# Altium project Bidirectional Charger P1.PrjPcb
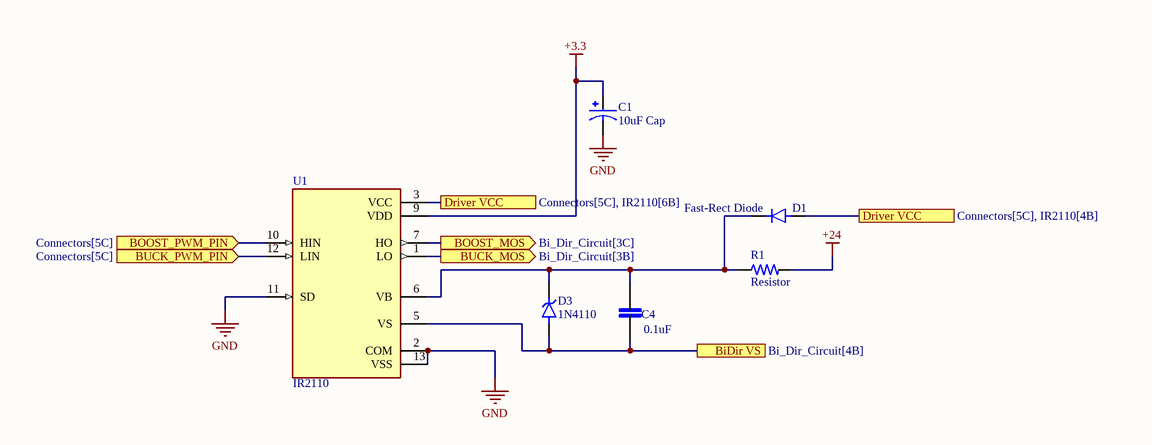
[diagram p0: IR2110.SchDoc]
3 sheets, 55 parts. Net scope: flat (ports and power ports of the same name join across sheets).
Board file: DC DC Board.PcbDoc
Sheets:
  IR2110.SchDoc
  Bi_Dir_Circuit.SchDoc
  Connectors.SchDoc

## Sheet IR2110.SchDoc
size A3; SheetNumber: 1; SheetTotal: 3

### Parts
C1  10uF Cap  [CAP_10uF]
C4  0.1uF  [Ceramic Capacitor]
D1  Fast-Rect Diode  [Common Trhough Hole]
D3  1N4110  [Common Trhough Hole]
R1  Resistor  [Resistor_Through Hole]
U1  IR2110  [IR2110]

### Ports
BiDir VS (see Bi_Dir_Circuit[4B]), BOOST_MOS (out, see Bi_Dir_Circuit[3C]), BOOST_PWM_PIN (in, see Connectors[5C]), BUCK_MOS (out, see Bi_Dir_Circuit[3B]), BUCK_PWM_PIN (in, see Connectors[5C]), Driver VCC (see Connectors[5C], IR2110[4B]), Driver VCC (see Connectors[5C], IR2110[6B])

### Nets
+3.3: C1.P U1.9(VDD)
+24: R1.2
GND: C1.N U1.2(COM) U1.11(SD) U1.13(VSS)
NetC4_1: C4.1 D3.2(A) U1.5(VS) ; port BiDir VS
NetC4_2: C4.2 D1.1(K) D3.1(K) R1.1 U1.6(VB)
NetD1_2: D1.2(A) U1.3(VCC) ; port Driver VCC
NetD7_C: U1.1(LO) ; port BUCK_MOS
NetD8_C: U1.7(HO) ; port BOOST_MOS
NetJ5_1: U1.10(HIN) ; port BOOST_PWM_PIN
NetJ5_3: U1.12(LIN) ; port BUCK_PWM_PIN

### Library data of the parts
C1 = 10uF Cap: CAP ALUM 10UF 20% 50V RADIAL; MP: ECE-A1HN100UI; MF: Panasonic; SnapEDA_Link: https://www.snapeda.com/parts/ECE-A1HN100UI/Panasonic/view-part/2321690/?ref=snap; Price: None; Check_prices: https://www.snapeda.com/parts/ECE-A1HN100UI/Panasonic/view-part/2321690/?ref=eda; Value: *; Availability: In Stock; Package: RADIAL-2 Panasonic
C4 = Ceramic Capacitor: MP: LD051A121KAB2A; MF: AVX; SnapEDA_Link: https://www.snapeda.com/parts/LD051A121KAB2A/AVX/view-part/?ref=snap; Package: 0805 AVX; Check_prices: https://www.snapeda.com/parts/LD051A121KAB2A/AVX/view-part/?ref=eda; Purchase-URL: https://pricing.snapeda.com/search/part/LD051A121KAB2A/?ref=eda; Price: None; Value: *; Availability: In Stock
D1 = Normal Diode: MF: NTE Electronics, Inc.; MP: 1N4007; Package: DO-41 NTE Electronics; Check_prices: https://www.snapeda.com/parts/1N4007/NTE+Electronics/view-part/?ref=eda; Value: *; Purchase-URL: https://pricing.snapeda.com/search/part/1N4007/?ref=eda; Availability: In Stock; SnapEDA_Link: https://www.snapeda.com/parts/1N4007/NTE+Electronics/view-part/?ref=snap; Price: None
D3 = Zener Diode: MP: 1SMA5926; MF: Taiwan Semiconductor; Package: SMA-2 Taiwan Semiconductor; Availability: In Stock; Purchase-URL: https://pricing.snapeda.com/search/part/1SMA5926/?ref=eda; SnapEDA_Link: https://www.snapeda.com/parts/1SMA5926/Taiwan+Semiconductor/view-part/?ref=snap; Price: None; Check_prices: https://www.snapeda.com/parts/1SMA5926/Taiwan+Semiconductor/view-part/?ref=eda; Value: *
R1 = Resistor: Power_Rating: .25 W; MP: 2-2176053-0; Tolerance: 1%; Resistance: .33; MF: TE Connectivity; Price: None; Availability: In Stock; EU_RoHS_Compliance: Compliant with Exemptions; Package: 0805; Value: *; SnapEDA_Link: https://www.snapeda.com/parts/2-2176053-0/TE+Connectivity/view-part/?ref=snap; Check_prices: https://www.snapeda.com/parts/2-2176053-0/TE+Connectivity/view-part/?ref=eda
U1 = IR2110: Half-Bridge Gate Driver IC Non-Inverting 16-SOIC; MF: Infineon; Package: SOIC-16 International Rectifier; Purchase-URL: https://pricing.snapeda.com/search/part/IR2110/?ref=eda; Value: *; SnapEDA_Link: https://www.snapeda.com/parts/IR2110/Infineon+Technologies/view-part/?ref=snap; Price: None; MP: IR2110; Check_prices: https://www.snapeda.com/parts/IR2110/Infineon+Technologies/view-part/?ref=eda; Availability: In Stock

## Sheet Bi_Dir_Circuit.SchDoc
size A2; SheetNumber: 2; SheetTotal: 3
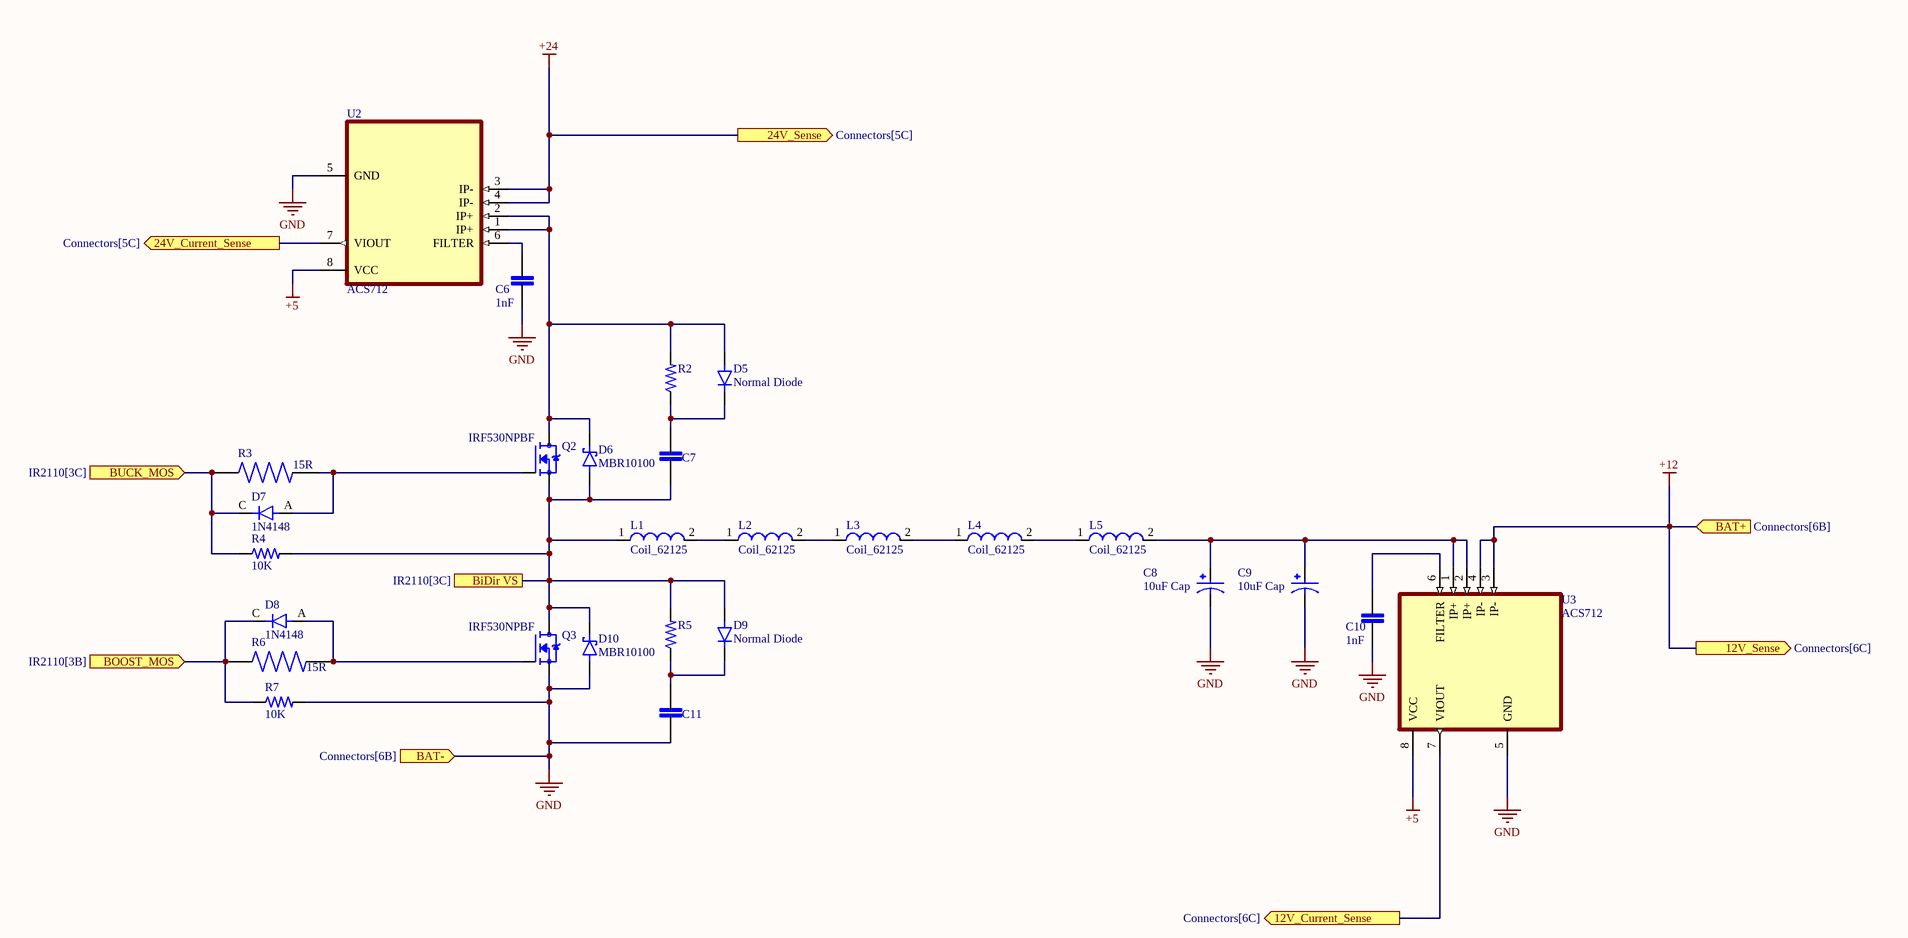
[diagram p1: Bi_Dir_Circuit.SchDoc]

### Parts
C6  1nF  [Ceramic Capacitor]
C7  Ceramic Capacitor  [Ceramic Capacitor]  (value not drawn)
C8  10uF Cap  [2200uF_Cap]
C9  10uF Cap  [2200uF_Cap]
C10  1nF  [Ceramic Capacitor]
C11  Ceramic Capacitor  [Ceramic Capacitor]  (value not drawn)
D5  Normal Diode  [Common Trhough Hole]
D6  MBR10100  [MBR10100]
D7  1N4148  [1N4007 DIODE]
D8  1N4148  [1N4007 DIODE]
D9  Normal Diode  [Common Trhough Hole]
D10  MBR10100  [MBR10100]
L1  Coil_62125  [Coil 65125]
L2  Coil_62125  [Coil 65125]
L3  Coil_62125  [Coil 65125]
L4  Coil_62125  [Coil 65125]
L5  Coil_62125  [Coil 65125]
Q2  IRF530NPBF  [IRF530N]
Q3  IRF530NPBF  [IRF530N]
R2  Resistor  [Resistor_Through Hole]  (value not drawn)
R3  15R  [Resistor_Through Hole]
R4  10K  [Resistor_Through Hole]
R5  Resistor  [Resistor_Through Hole]  (value not drawn)
R6  15R  [Resistor_Through Hole]
R7  10K  [Resistor_Through Hole]
U2  ACS712  [ACS712]
U3  ACS712  [ACS712]

### Ports
12V_Current_Sense (out, see Connectors[6C]), 12V_Sense (out, see Connectors[6C]), 24V_Current_Sense (out, see Connectors[5C]), 24V_Sense (out, see Connectors[5C]), BAT+ (in, see Connectors[6B]), BAT- (in, see Connectors[6B]), BiDir VS (see IR2110[3C]), BOOST_MOS (in, see IR2110[3B]), BUCK_MOS (in, see IR2110[3C])

### Nets
+5: U2.8(VCC) U3.8(VCC)
+12: U3.3(IP-) U3.4(IP-) ; port 12V_Sense, port BAT+
+24: U2.3(IP-) U2.4(IP-) ; port 24V_Sense
GND: C6.1 C8.N C9.N C10.1 C11.1 D10.3(A) Q3.3(S) R7.2 U2.5(GND) U3.5(GND) ; port BAT-
NetC4_1: C7.1 D6.3(A) D9.2(A) D10.1(K) L1.1 Q2.3(S) Q3.2(D) R4.2 R5.2 ; port BiDir VS
NetC6_2: C6.2 U2.6(FILTER)
NetC7_2: C7.2 D5.1(K) R2.1
NetC8_P: C8.P C9.P L5.2 U3.1(IP+) U3.2(IP+)
NetC10_2: C10.2 U3.6(FILTER)
NetC11_2: C11.2 D9.1(K) R5.1
NetD5_2: D5.2(A) D6.1(K) Q2.2(D) R2.2 U2.1(IP+) U2.2(IP+)
NetD7_A: D7.A Q2.1(G) R3.2
NetD7_C: D7.C R3.1 R4.1 ; port BUCK_MOS
NetD8_A: D8.A Q3.1(G) R6.2
NetD8_C: D8.C R6.1 R7.1 ; port BOOST_MOS
NetJ4_2: U3.7(VIOUT) ; port 12V_Current_Sense
NetJ4_3: U2.7(VIOUT) ; port 24V_Current_Sense
NetL1_2: L1.2 L2.1
NetL2_2: L2.2 L3.1
NetL3_2: L3.2 L4.1
NetL4_2: L4.2 L5.1

### Library data of the parts
C6 C7 C10 C11 = Ceramic Capacitor: MP: LD051A121KAB2A; MF: AVX; SnapEDA_Link: https://www.snapeda.com/parts/LD051A121KAB2A/AVX/view-part/?ref=snap; Package: 0805 AVX; Check_prices: https://www.snapeda.com/parts/LD051A121KAB2A/AVX/view-part/?ref=eda; Purchase-URL: https://pricing.snapeda.com/search/part/LD051A121KAB2A/?ref=eda; Price: None; Value: *; Availability: In Stock
C8 C9 = 10uF Cap: as C1 on sheet IR2110; SnapEDA_Link: https://www.snapeda.com/parts/ECE-A1HN100UI/Panasonic/view-part/2321690/?ref=snap; Price: None; Check_prices: https://www.snapeda.com/parts/ECE-A1HN100UI/Panasonic/view-part/2321690/?ref=eda; Value: *; Availability: In Stock; Package: RADIAL-2 Panasonic
D5 D9 = Normal Diode: MF: NTE Electronics, Inc.; MP: 1N4007; Package: DO-41 NTE Electronics; Check_prices: https://www.snapeda.com/parts/1N4007/NTE+Electronics/view-part/?ref=eda; Value: *; Purchase-URL: https://pricing.snapeda.com/search/part/1N4007/?ref=eda; Availability: In Stock; SnapEDA_Link: https://www.snapeda.com/parts/1N4007/NTE+Electronics/view-part/?ref=snap; Price: None
D6 D10 = MBR10100: MF: Diodes Inc.; MP: 1N5817-T; Package: DO-41 Diodes Inc.; Price: None; Check_prices: https://www.snapeda.com/parts/1N5817-T/Diodes+Inc./view-part/?ref=eda; Value: *; SnapEDA_Link: https://www.snapeda.com/parts/1N5817-T/Diodes+Inc./view-part/?ref=snap; Availability: In Stock; Purchase-URL: https://pricing.snapeda.com/search/part/1N5817-T/?ref=eda
D7 D8 = 1N4007: Diode Standard 1000 V 1A Through Hole DO-41; MF: NTE Electronics, Inc.; Package: DO-41 NTE Electronics; Check_prices: https://www.snapeda.com/parts/1N4007/NTE+Electronics/view-part/?ref=eda; Value: *; Purchase-URL: https://pricing.snapeda.com/search/part/1N4007/?ref=eda; Availability: In Stock; SnapEDA_Link: https://www.snapeda.com/parts/1N4007/NTE+Electronics/view-part/?ref=snap; MP: 1N4007; Price: None
L1-L5 = Coil_62125: Inductor Power Wirewound 470uH 10% 1KHz 25Q-Factor Ferrite 210mA 3.3Ohm DCR T/R; MF: Bourns; MP: SDR0604-471KL; Digi-Key_Part_Number: SDR0604-471KLCT-ND; Package: Nonstandard Bourns; Value: *; SnapEDA_Link: https://www.snapeda.com/parts/SDR0604-471KL/Bourns/view-part/567387/?ref=snap; Digi-Key_Purchase_URL: https://www.digikey.com/product-detail/en/bourns-inc/SDR0604-471KL/SDR0604-471KLCT-ND/2352941?utm_source=snapeda&utm_medium=aggregator&utm_campaign=symbol
Q2 Q3 = IRF530NPBF: RoHS Compliant | Low RDS(on) | Industry-leading quality | Dynamic dv/dt Rating | Fast Switching | Fully Avalanche Rated | 175C Operating Temperature; MF: Infineon Technologies; Purchase-URL: https://pricing.snapeda.com/search/part/IRF530NPBF/?ref=eda; Check_prices: https://www.snapeda.com/parts/IRF530NPBF/Infineon+Technologies/view-part/?ref=eda; SnapEDA_Link: https://www.snapeda.com/parts/IRF530NPBF/Infineon+Technologies/view-part/?ref=snap; Price: None; Availability: In Stock; Package: TO-220 Infineon; MP: IRF530NPBF; Value: *
R2 R4 R5 R7 = Resistor: as R1 on sheet IR2110; Price: None; Availability: In Stock; EU_RoHS_Compliance: Compliant with Exemptions; Package: 0805; Value: *; SnapEDA_Link: https://www.snapeda.com/parts/2-2176053-0/TE+Connectivity/view-part/?ref=snap; Check_prices: https://www.snapeda.com/parts/2-2176053-0/TE+Connectivity/view-part/?ref=eda
R3 R6 = Resistor_Through Hole: 1.02 Ohms Â±1% 0.25W, 1/4W Through Hole Resistor Axial Metal Film; MP: MFR-25FTE52-1R; MF: Yageo; Availability: Warning; Value: *; Check_prices: https://www.snapeda.com/parts/MFR-25FTE52-1R/Yageo/view-part/4629919/?ref=eda; Package: Axial Yageo; Price: None; SnapEDA_Link: https://www.snapeda.com/parts/MFR-25FTE52-1R/Yageo/view-part/4629919/?ref=snap; Purchase-URL: https://pricing.snapeda.com/search/part/MFR-25FTE52-1R/?ref=eda
U2 U3 = ACS712: Current Sensor 5A 1 Channel Hall Effect, Open Loop Bidirectional 8-SOIC (0.154, 3.90mm Width); MP: ACS712ELCTR-05B-T; MF: Allegro MicroSystems LLC; SnapEDA_Link: https://www.snapeda.com/parts/ACS712ELCTR-05B-T/Allegro+MicroSystems+LLC/view-part/?ref=snap; Package: SOIC-8 Allegro MicroSystems LLC; Check_prices: https://www.snapeda.com/parts/ACS712ELCTR-05B-T/Allegro+MicroSystems+LLC/view-part/?ref=eda; Purchase-URL: https://pricing.snapeda.com/search/part/ACS712ELCTR-05B-T/?ref=eda; Price: None; Value: *; Availability: In Stock

## Sheet Connectors.SchDoc
size A3; SheetNumber: 3; SheetTotal: 3
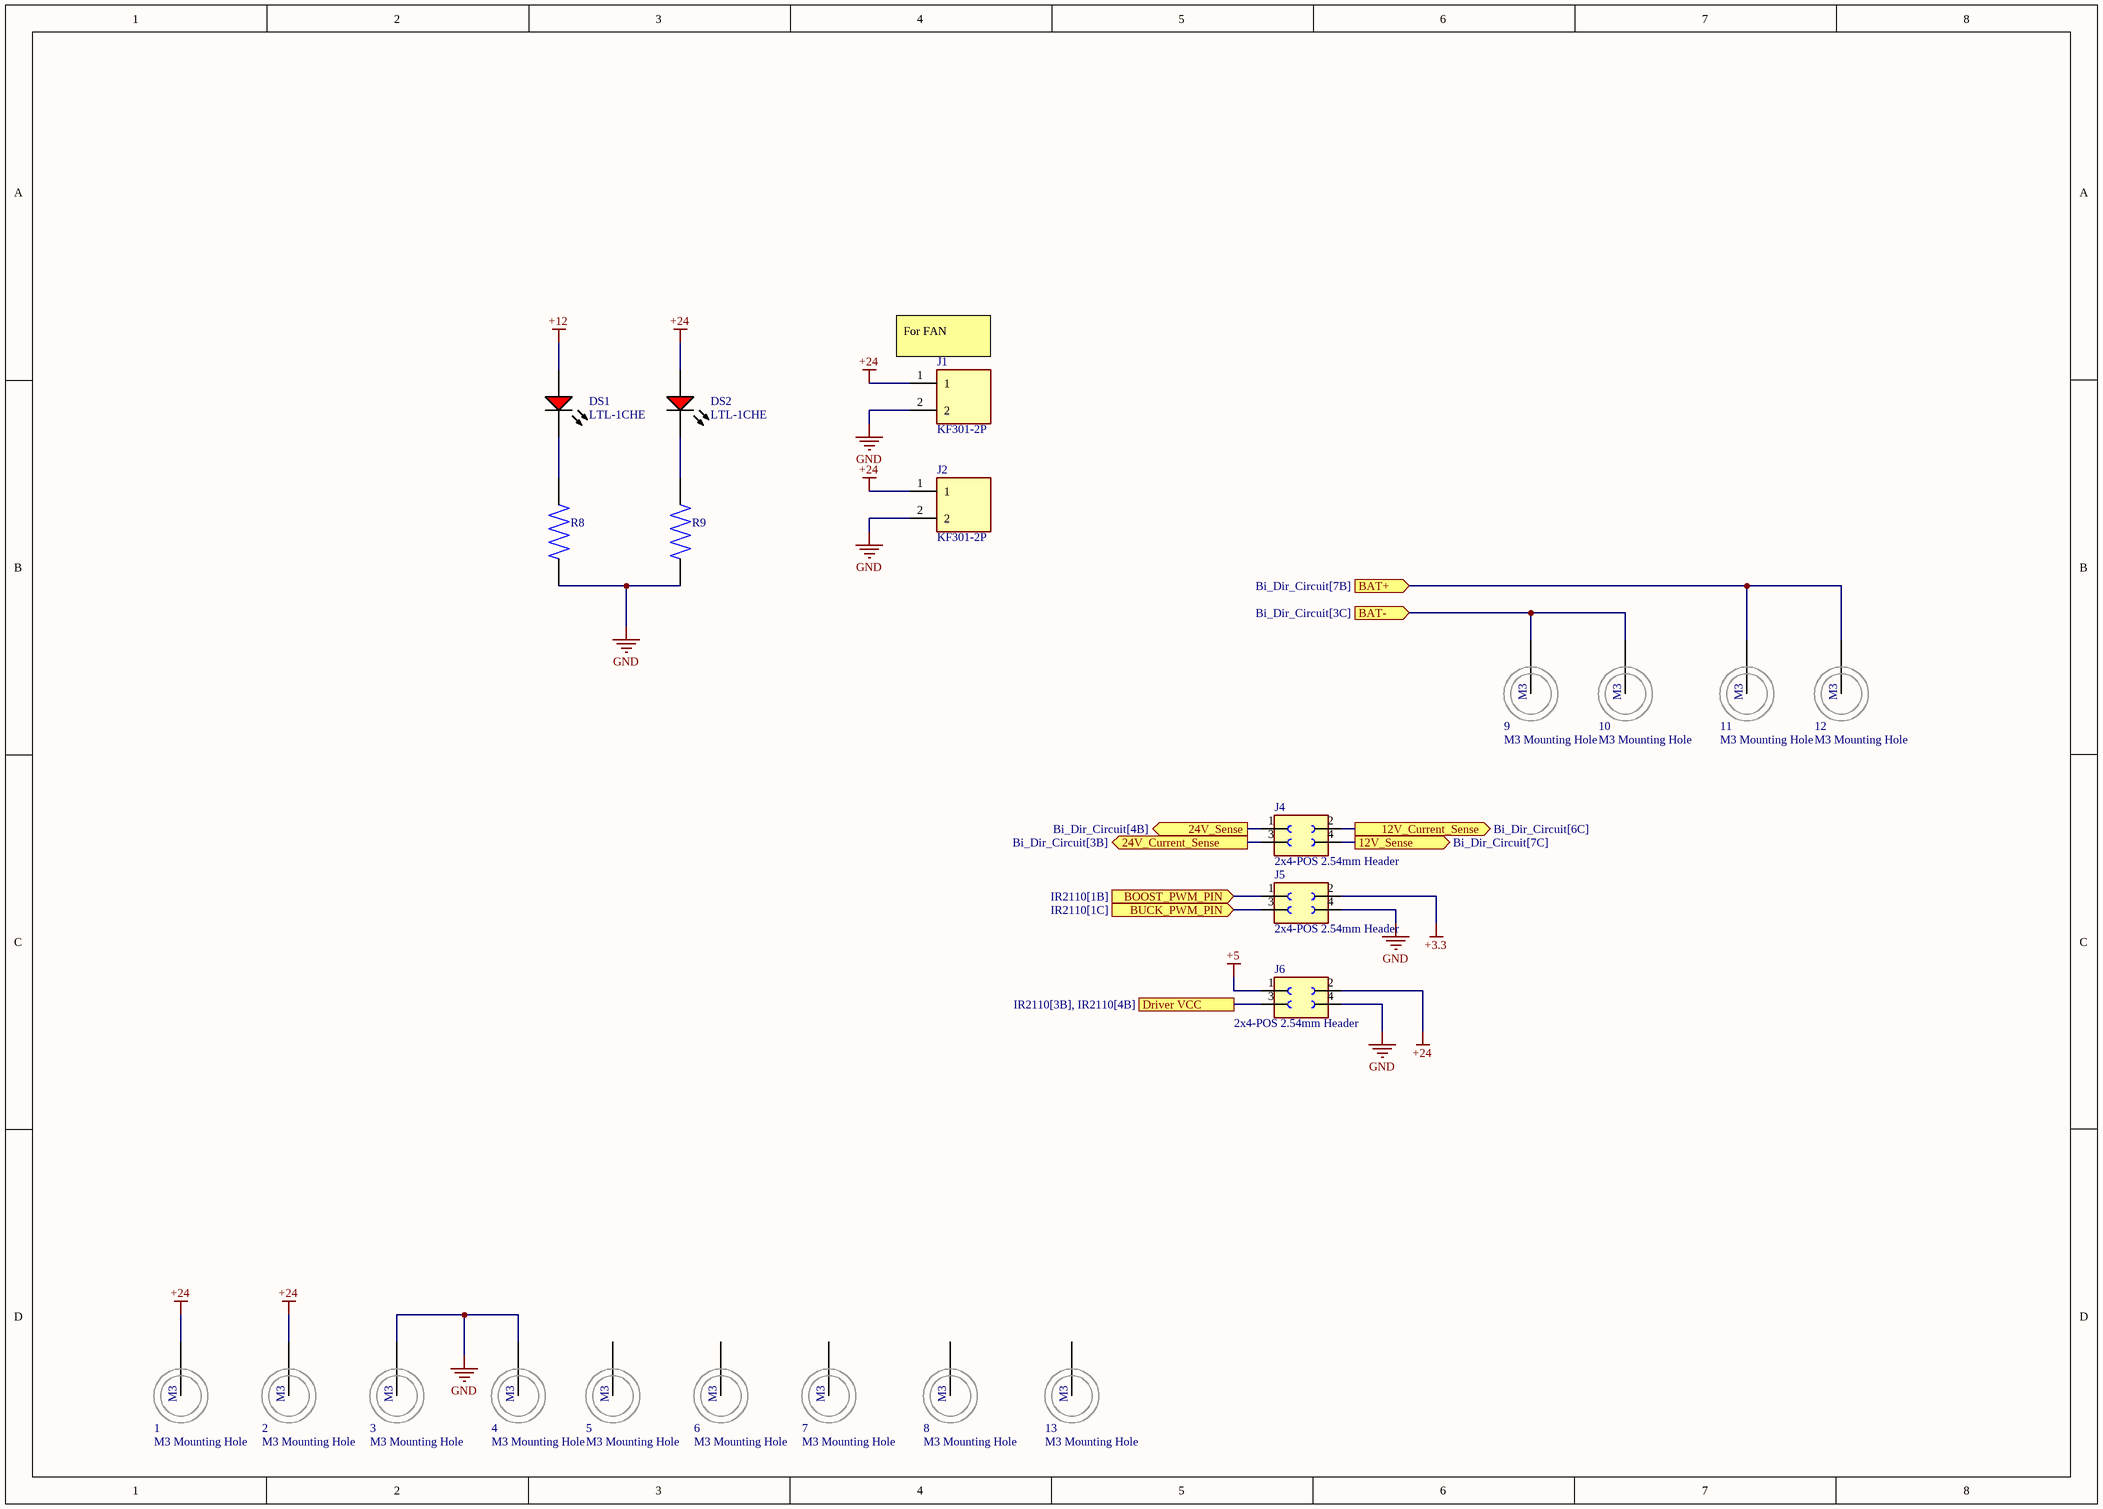
[diagram p2: Connectors.SchDoc]

### Parts
1  M3 Mounting Hole  [M3 - Mounting Hole]
2  M3 Mounting Hole  [M3 - Mounting Hole]
3  M3 Mounting Hole  [M3 - Mounting Hole]
4  M3 Mounting Hole  [M3 - Mounting Hole]
5  M3 Mounting Hole  [M3 - Mounting Hole]
6  M3 Mounting Hole  [M3 - Mounting Hole]
7  M3 Mounting Hole  [M3 - Mounting Hole]
8  M3 Mounting Hole  [M3 - Mounting Hole]
9  M3 Mounting Hole  [M3 - Mounting Hole]
10  M3 Mounting Hole  [M3 - Mounting Hole]
11  M3 Mounting Hole  [M3 - Mounting Hole]
12  M3 Mounting Hole  [M3 - Mounting Hole]
13  M3 Mounting Hole  [M3 - Mounting Hole]
DS1  LTL-1CHE  [LED3mm]
DS2  LTL-1CHE  [LED3mm]
J1  KF301-2P  [KF301-2P]
J2  KF301-2P  [KF301-2P]
J4  2x4-POS 2.54mm Header  [2x4-POS 2.54mm Header]
J5  2x4-POS 2.54mm Header  [2x4-POS 2.54mm Header]
J6  2x4-POS 2.54mm Header  [2x4-POS 2.54mm Header]
R8  Resistor_Through Hole  [Resistor_Through Hole]  (value not drawn)
R9  Resistor_Through Hole  [Resistor_Through Hole]  (value not drawn)

### Ports
12V_Current_Sense (out, see Bi_Dir_Circuit[6C]), 12V_Sense (out, see Bi_Dir_Circuit[7C]), 24V_Current_Sense (out, see Bi_Dir_Circuit[3B]), 24V_Sense (out, see Bi_Dir_Circuit[4B]), BAT+ (in, see Bi_Dir_Circuit[7B]), BAT- (in, see Bi_Dir_Circuit[3C]), BOOST_PWM_PIN (in, see IR2110[1B]), BUCK_PWM_PIN (in, see IR2110[1C]), Driver VCC (see IR2110[3B], IR2110[4B])

### Nets
+3.3: J5.2
+5: J6.1
+12: 11.1(M3) 12.1(M3) DS1.1(A) J4.4 ; port BAT+, port 12V_Sense
+24: 1.1(M3) 2.1(M3) DS2.1(A) J1.1 J2.1 J4.1 J6.2 ; port 24V_Sense
GND: 3.1(M3) 4.1(M3) 9.1(M3) 10.1(M3) J1.2 J2.2 J5.4 J6.4 R8.2 R9.2 ; port BAT-
NetD1_2: J6.3 ; port Driver VCC
NetDS1_2: DS1.2(K) R8.1
NetDS2_2: DS2.2(K) R9.1
NetJ4_2: J4.2 ; port 12V_Current_Sense
NetJ4_3: J4.3 ; port 24V_Current_Sense
NetJ5_1: J5.1 ; port BOOST_PWM_PIN
NetJ5_3: J5.3 ; port BUCK_PWM_PIN

Not connected (* = marked no-connect by the designer): 5 1(M3); 6 1(M3); 7 1(M3); 8 1(M3); 13 1(M3)

### Notes on the sheet
- (near J1) For FAN

### Library data of the parts
DS1 DS2 = RED_LED 3mm: Radial LED, 12.6 mcd, 20 mA, 2 V, -55 to 100 degC, 2-Pin THD, RoHS, Bulk; Shielding: Unshielded; Resistance: 0.045 Ohm; Current Rating: 3.6 A; Tolerance: 20%; PackageReference: LTL-1CHE; PackageDescription: 2-Pin Through Hole Device, Dia 3.8 mm, Pitch 2.54 mm; Case\Package: Radial; Length: 0.97 inch; Width: 0.62 inch; Height: 1.1 inch; Radiation Hardening: No; Lead Pitch: 11.44 mm; ComponentLink1URL: http://www.us.liteon.com/; ComponentLink1Description: Manufacturer URL; RoHSCompliant: true; Packaging: Tray; Mount: Through Hole; Min Operating Temperature: -40 degC; Max Operating Temperature: 130 degC; ComponentLink2URL: https://datasheet.ciiva.com/15117/getdatasheetpartid-187746-15117985.pdf; Package Quantity: 55; ComponentLink2Description: Datasheet; DatasheetVersion: Dec-03
J1 J2 = KF301-2P: 2 Pin Terminal Block 5mm Pitch; Price: None; Value: *; MP: KF301-2P; Package: None; Availability: Unavailable
J4-J6 = 2x4-POS 2.54mm Header: Female header [WÃ¼rth Elektronik] 613004243121 Female header; SnapEDA_Link: https://www.snapeda.com/parts/613004243121/W%C3%BCrth%20Elektronik/view-part/1737074/?ref=snap; Check_prices: https://www.snapeda.com/parts/613004243121/W%C3%BCrth%20Elektronik/view-part/1737074/?ref=eda; Availability: Unavailable; Value: *; MF: WÃ¼rth Elektronik; Price: None; MP: 613004243121; Package: None
R8 R9 = Resistor_Through Hole: as R3 on sheet Bi_Dir_Circuit; Availability: Warning; Value: *; Check_prices: https://www.snapeda.com/parts/MFR-25FTE52-1R/Yageo/view-part/4629919/?ref=eda; Package: Axial Yageo; Price: None; SnapEDA_Link: https://www.snapeda.com/parts/MFR-25FTE52-1R/Yageo/view-part/4629919/?ref=snap; Purchase-URL: https://pricing.snapeda.com/search/part/MFR-25FTE52-1R/?ref=eda

## Nets that join several sheets
+3.3: IR2110 (C1.P U1.9), Connectors (J5.2)
+5: Bi_Dir_Circuit (U2.8 U3.8), Connectors (J6.1)
+12: Bi_Dir_Circuit (U3.3 U3.4), Connectors (11.1 12.1 DS1.1 J4.4)
+24: IR2110 (R1.2), Bi_Dir_Circuit (U2.3 U2.4), Connectors (7 pins)
GND: IR2110 (C1.N U1.2 U1.11 U1.13), Bi_Dir_Circuit (10 pins), Connectors (10 pins)
NetC4_1: IR2110 (C4.1 D3.2 U1.5), Bi_Dir_Circuit (9 pins)
NetD1_2: IR2110 (D1.2 U1.3), Connectors (J6.3)
NetD7_C: IR2110 (U1.1), Bi_Dir_Circuit (D7.C R3.1 R4.1)
NetD8_C: IR2110 (U1.7), Bi_Dir_Circuit (D8.C R6.1 R7.1)
NetJ4_2: Bi_Dir_Circuit (U3.7), Connectors (J4.2)
NetJ4_3: Bi_Dir_Circuit (U2.7), Connectors (J4.3)
NetJ5_1: IR2110 (U1.10), Connectors (J5.1)
NetJ5_3: IR2110 (U1.12), Connectors (J5.3)